# Altium schematic sheet CODEC.SchDoc: Codec
size A4; SheetNumber: 4; SheetTotal: 6
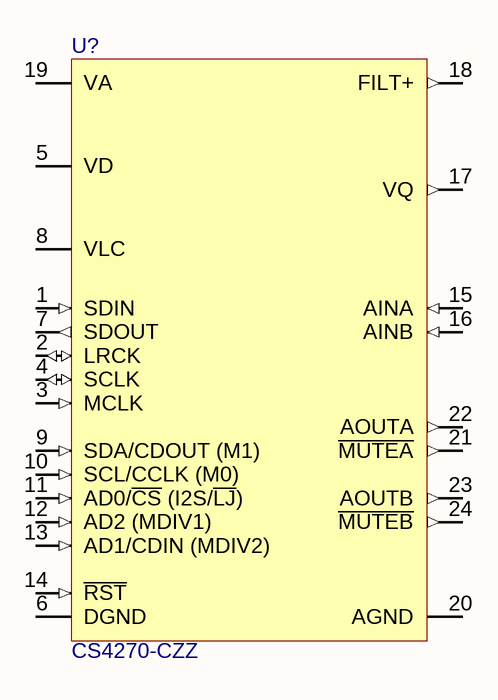
[diagram p0: CODEC.SchDoc]

## Parts
U?  CS4270-CZZ  [CIR-TSSOP-24-L]

## Nets

Not connected (* = marked no-connect by the designer): U? 1(SDIN) 2(LRCK) 3(MCLK) 4(SCLK) 5(VD) 6(DGND) 7(SDOUT) 8(VLC) 9(SDA/CDOUT_(M1)) 10(SCL/CCLK_(M0)) 11(AD0/~{CS}_(I2S/~{LJ})) 12(AD2_(MDIV1)) 13(AD1/CDIN_(MDIV2)) 14(~{RST}) 15(AINA) 16(AINB) 17(VQ) 18(FILT+) 19(VA) 20(AGND) 21(~{MUTEA}) 22(AOUTA) 23(AOUTB) 24(~{MUTEB})

## Notes on the sheet
- TITLE
- DRAWN BY
- DATE
- PROJECT
- FILE
- SHEET SIZE
- A4
- REVISION
- PAGE
- of

## Library data of the parts
U? = CS4270-CZZ: IC CODEC 24BIT 105DB 24TSSOP; Supplier 1: Digi-Key; Supplier 2: Mouser; Supplier Part Number 1: 598-1040-5-ND; Supplier Part Number 2: 777-CS4270-CZZ